# Altium schematic sheet Power.SchDoc: Power Supplies
size Tabloid; Organization: Davis Designs; Address1: Flycatcher Labs; SheetNumber: 4; SheetTotal: 6
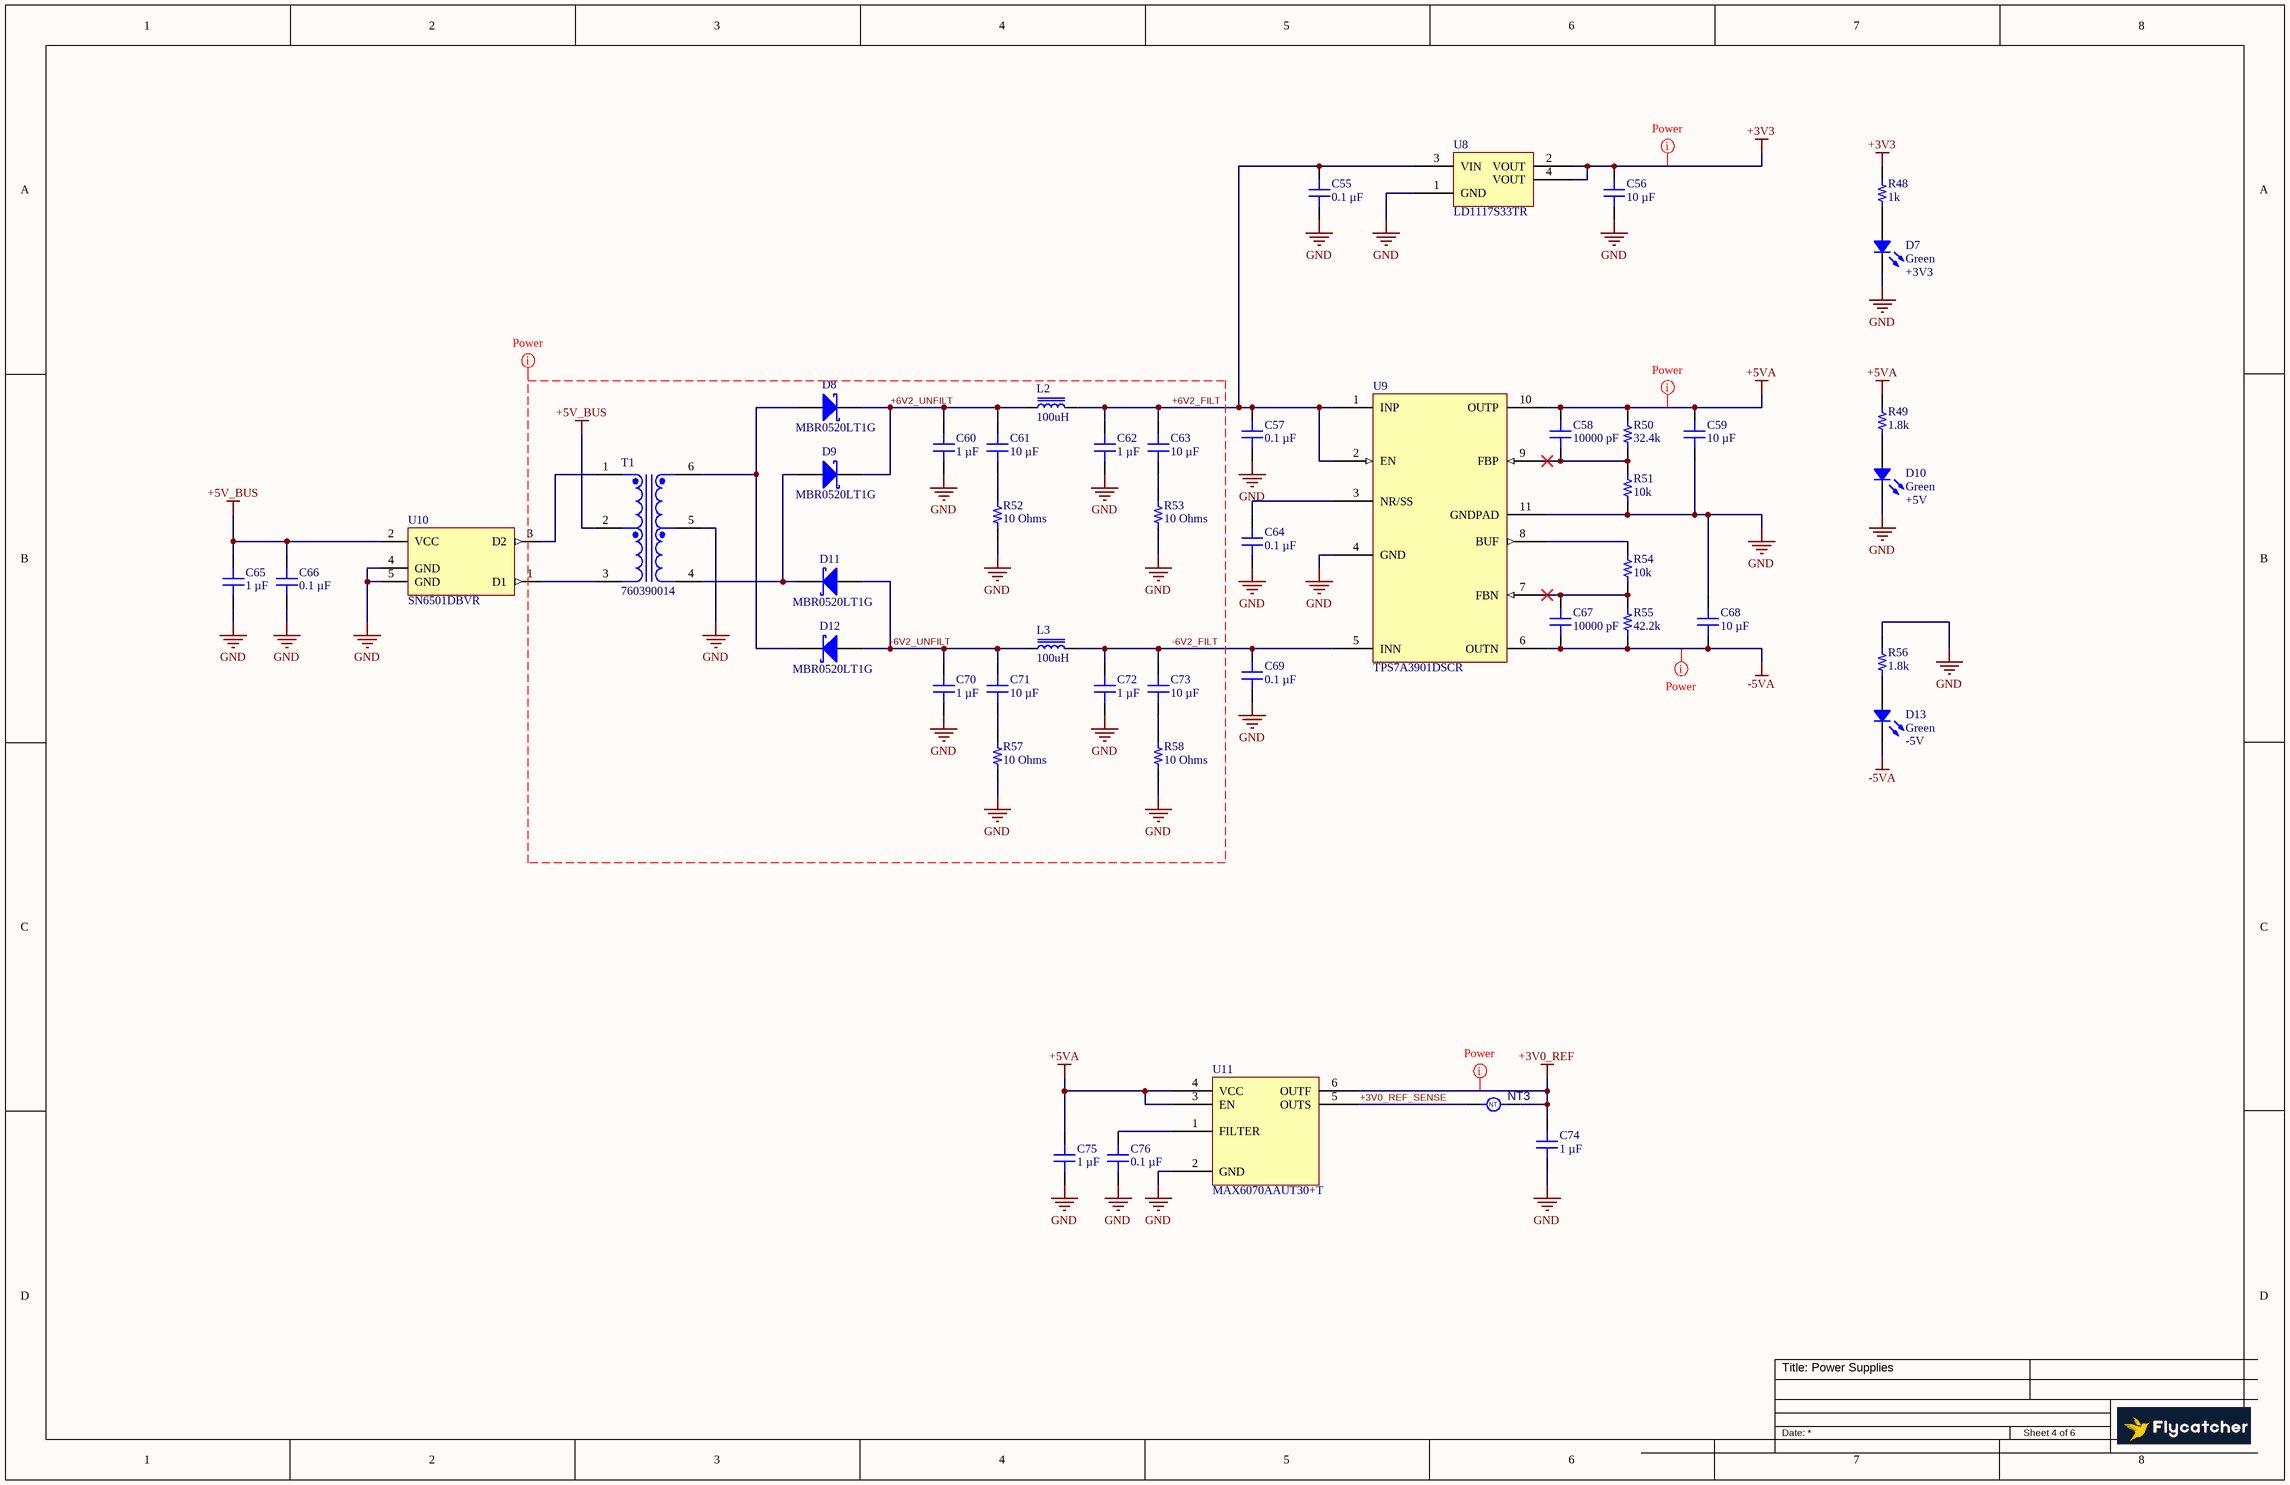
[diagram p0: Power.SchDoc]

## Parts
C55  0.1 µF  [MURATA GRM155 0402_1005]
C56  10 µF  [CAP 0805_2012]
C57  0.1 µF  [MURATA GRM155 0402_1005]
C58  10000 pF  [MURATA GRM155 0402_1005]
C59  10 µF  [CAP 0805_2012]
C60  1 µF  [MURATA GRM155 0402_1005]
C61  10 µF  [CAP 0805_2012]
C62  1 µF  [MURATA GRM155 0402_1005]
C63  10 µF  [CAP 0805_2012]
C64  0.1 µF  [MURATA GRM155 0402_1005]
C65  1 µF  [MURATA GRM155 0402_1005]
C66  0.1 µF  [MURATA GRM155 0402_1005]
C67  10000 pF  [MURATA GRM155 0402_1005]
C68  10 µF  [CAP 0805_2012]
C69  0.1 µF  [MURATA GRM155 0402_1005]
C70  1 µF  [MURATA GRM155 0402_1005]
C71  10 µF  [CAP 0805_2012]
C72  1 µF  [MURATA GRM155 0402_1005]
C73  10 µF  [CAP 0805_2012]
C74  1 µF  [MURATA GRM155 0402_1005]
C75  1 µF  [MURATA GRM155 0402_1005]
C76  0.1 µF  [MURATA GRM155 0402_1005]
D7  +3V3  value Green  [LED 0402_1005 GREEN]
D8  MBR0520LT1G  [ONSC-SOD-123-2-425-04_V]
D9  MBR0520LT1G  [ONSC-SOD-123-2-425-04_V]
D10  +5V  value Green  [LED 0402_1005 GREEN]
D11  MBR0520LT1G  [ONSC-SOD-123-2-425-04_V]
D12  MBR0520LT1G  [ONSC-SOD-123-2-425-04_V]
D13  -5V  value Green  [LED 0402_1005 GREEN]
L2  value 100uH  [FP-SRN4030HA-MFG]  (hidden comment: SRN4030HA-101M)
L3  value 100uH  [FP-SRN4030HA-MFG]  (hidden comment: SRN4030HA-101M)
NT3  Net Tie 10x8mil  [New footprint 1]  (value not drawn)  (net tie, no BOM)
R48  1k  [RES 0402_1005]
R49  1.8k  [RES 0402_1005]
R50  32.4k  [RES 0402_1005]
R51  10k  [RES 0402_1005]
R52  10 Ohms  [RES 0402_1005]
R53  10 Ohms  [RES 0402_1005]
R54  10k  [RES 0402_1005]
R55  42.2k  [RES 0402_1005]
R56  1.8k  [RES 0402_1005]
R57  10 Ohms  [RES 0402_1005]
R58  10 Ohms  [RES 0402_1005]
T1  760390014  [WE-760390014-6_V]
U8  LD1117S33TR  [ST SOT-223]
U9  TPS7A3901DSCR  [FP-DSC0010J-MFG]
U10  SN6501DBVR  [FP-DBV0005A-MFG]
U11  MAX6070AAUT30+T  [MAXIM SOT-23-6]

## Nets
+3V0_REF: C74.2 NT3.2 U11.6(OUTF)
+3V3: C56.2 R48.2 U8.2(VOUT) U8.4(VOUT)
+5V_BUS: C65.2 C66.2 T1.2 U10.2(VCC)
+5VA: C58.2 C59.2 C75.2 R49.2 R50.2 U9.10(OUTP) U11.3(EN) U11.4(VCC)
-5VA: C67.1 C68.1 D13.2 R55.1 U9.6(OUTN)
GND: C55.1 C56.1 C57.1 C59.1 C60.1 C62.1 C64.1 C65.1 C66.1 C68.2 C69.1 C70.1 C72.1 C74.1 C75.1 C76.1 D7.2 D10.2 R51.2 R52.1 R53.1 R56.2 R57.1 R58.1 T1.5 U8.1(GND) U9.4(GND) U9.11(GNDPAD) U10.4(GND) U10.5(GND) U11.2(GND)
+3V0_REF_SENSE: NT3.1 U11.5(OUTS)
+6V2_FILT: C55.2 C57.2 C62.2 C63.2 L2.2 U8.3(VIN) U9.1(INP) U9.2(EN)
+6V2_UNFILT: C60.2 C61.2 D8.2(K) D9.2(K) L2.1
-6V2_FILT: C69.2 C72.2 C73.2 L3.2 U9.5(INN)
-6V2_UNFILT: C70.2 C71.2 D11.1(A) D12.1(A) L3.1
NetC58_1: C58.1 R50.1 R51.1 U9.9(FBP)
NetC61_1: C61.1 R52.2
NetC63_1: C63.1 R53.2
NetC64_2: C64.2 U9.3(NR/SS)
NetC67_2: C67.2 R54.2 R55.2 U9.7(FBN)
NetC71_1: C71.1 R57.2
NetC73_1: C73.1 R58.2
NetC76_2: C76.2 U11.1(FILTER)
NetD7_1: D7.1 R48.1
NetD8_1: D8.1(A) D12.2(K) T1.6
NetD9_1: D9.1(A) D11.2(K) T1.4
NetD10_1: D10.1 R49.1
NetD13_1: D13.1 R56.1
NetR54_1: R54.1 U9.8(BUF)
NetT1_1: T1.1 U10.3(D2)
NetT1_3: T1.3 U10.1(D1)

## Layout directives
net class Power: +3V0_REF, +3V3, +5V_BUS, +5VA, +6V2_FILT, +6V2_UNFILT, -5VA, -6V2_FILT, -6V2_UNFILT, GND

## Notes on the sheet
- (in symbol CMP-009-00116-4) NT

## Library data of the parts
C55 C57 C64 C66 C69 C76 = GRM155R61H104KE19D: CAP CER 0.1UF 50V X5R 0402; manufacturer: Murata Electronics; Tolerance: ±10%; Part Number: GRM155R61H104KE19D; Value: 0.1 µF; Applications: General Purpose; Capacitance: 0.1 µF; componentlink1description: Datasheet; componentlink1url: https://search.murata.co.jp/Ceramy/image/img/A01X/G101/ENG/GRM155R61H104KE19-01.pdf; componentlink2description: DigiKey Link; componentlink2url: https://www.digikey.com/en/products/detail/murata-electronics/GRM155R61H104KE19D/5360887; Device Package: 0402 (1005 Metric); lastupdated: 7/25/2024 4:50:24 AM; Lifecycle Status: Active; Minimum Order: 1; Mounting Type: Surface Mount, MLCC; Operating Temperature: -55°C ~ 85°C; Package / Case: 0402 (1005 Metric); packaging: TapeAndReel; partid: 2975; Part Status: Active; price: 0.01; series: GRM; Size / Dimension: 0.039" L x 0.020" W (1.00mm x 0.50mm); Supplier 1: DigiKey; Supplier Part Number 1: 490-11917-1-ND; Temperature Coefficient: X5R; Thickness (Max): 0.022" (0.55mm); Voltage - Rated: 50V
C56 C59 C61 C63 C68 C71 C73 = GCM21BC71E106KE36L: CAP CER 10UF 25V X7S 0805; manufacturer: Murata Electronics; Tolerance: ±10%; Part Number: GCM21BC71E106KE36L; Value: 10 µF; Applications: Automotive; Capacitance: 10 µF; componentlink1description: Datasheet; componentlink1url: https://search.murata.co.jp/Ceramy/image/img/A01X/G101/ENG/GCM21BC71E106KE36-01A.pdf; componentlink2description: DigiKey Link; componentlink2url: https://www.digikey.com/en/products/detail/murata-electronics/GCM21BC71E106KE36L/16821116; Device Package: 0805 (2012 Metric); lastupdated: 2/9/2024 8:14:44 PM; Lifecycle Status: Active; Minimum Order: 1; Mounting Type: Surface Mount, MLCC; Operating Temperature: -55°C ~ 125°C; Package / Case: 0805 (2012 Metric); packaging: TapeAndReel; partid: 48794; Part Status: Active; price: 0.09; Ratings: AEC-Q200; series: GCM; Size / Dimension: 0.079" L x 0.049" W (2.00mm x 1.25mm); Supplier 1: DigiKey; Supplier Part Number 1: 490-GCM21BC71E106KE36LCT-ND; Temperature Coefficient: X7S; Thickness (Max): 0.057" (1.45mm); Voltage - Rated: 25V
C58 C67 = GRM1555CYA103GE01D: CAP CER 10000PF 35V C0G/NP0 0402; manufacturer: Murata Electronics; Temperature Coefficient: C0G, NP0; Tolerance: ±2%; Part Number: GRM1555CYA103GE01D; Value: 10000 pF; Applications: General Purpose; Capacitance: 10000 pF; componentlink1description: Datasheet; componentlink1url: https://search.murata.co.jp/Ceramy/image/img/A01X/G101/ENG/GRM1555CYA103GE01-01A.pdf; componentlink2description: DigiKey Link; componentlink2url: https://www.digikey.com/en/products/detail/murata-electronics/GRM1555CYA103GE01D/16033798; Device Package: 0402 (1005 Metric); lastupdated: 8/27/2024 12:42:50 PM; Lifecycle Status: Active; Minimum Order: 1; Mounting Type: Surface Mount, MLCC; Operating Temperature: -55°C ~ 125°C; Package / Case: 0402 (1005 Metric); packaging: TapeAndReel; partid: 41078; Part Status: Active; price: 0.02; series: GRM; Size / Dimension: 0.039" L x 0.020" W (1.00mm x 0.50mm); Supplier 1: DigiKey; Supplier Part Number 1: 490-GRM1555CYA103GE01DCT-ND; Thickness (Max): 0.026" (0.65mm); Voltage - Rated: 35V
C60 C62 C65 C70 C72 C74 C75 = GRM155R61E105MA12D: CAP CER 1UF 25V X5R 0402; manufacturer: Murata Electronics; Tolerance: ±20%; Part Number: GRM155R61E105MA12D; Value: 1 µF; Applications: General Purpose; Capacitance: 1 µF; componentlink1description: Datasheet; componentlink1url: https://search.murata.co.jp/Ceramy/image/img/A01X/G101/ENG/GRM155R61E105MA12-01.pdf; componentlink2description: DigiKey Link; componentlink2url: https://www.digikey.com/en/products/detail/murata-electronics/GRM155R61E105MA12D/4905141; Device Package: 0402 (1005 Metric); lastupdated: 7/25/2024 4:50:24 AM; Lifecycle Status: Active; Minimum Order: 1; Mounting Type: Surface Mount, MLCC; Operating Temperature: -55°C ~ 85°C; Package / Case: 0402 (1005 Metric); packaging: TapeAndReel; partid: 3014; Part Status: Active; price: 0.01; series: GRM; Size / Dimension: 0.039" L x 0.020" W (1.00mm x 0.50mm); Supplier 1: DigiKey; Supplier Part Number 1: 490-10018-1-ND; Temperature Coefficient: X5R; Thickness (Max): 0.022" (0.55mm); Voltage - Rated: 25V
D7 D10 D13 = HSMG-C280: LED GREEN DIFFUSED 0402 SMD; Manufacturer: Broadcom Limited; Configuration: Standard; Current - Test: 20mA; Lens Color: White; Lens Size: 1.00mm x 0.50mm; Lens Style: Rectangle with Flat Top; Millicandela Rating: 15mcd; Viewing Angle: 130°; Voltage - Forward (Vf) (Typ): 2.2V; Wavelength - Dominant: 572nm; Wavelength - Peak: 570nm; Part Number: HSMG-C280; Color: Green; ComponentLink1Description: Datasheet; ComponentLink1URL: https://docs.broadcom.com/docs/AV02-0602EN; ComponentLink2Description: DigiKey Link; ComponentLink2URL: https://www.digikey.com/en/products/detail/broadcom-limited/HSMG-C280/1235358; Device Package: 0402 (1005 Metric); Height (Max): 0.40mm; LastUpdated: 3/11/2024 7:50:32 AM; Lens Transparency: Diffused; Lifecycle Status: Active; Minimum Order: 1; Mounting Type: Surface Mount; Package / Case: 0402 (1005 Metric); Packaging: TapeAndReel; PartId: 697; Part Status: Active; Price: 0.08; Series: -; Size / Dimension: 1.00mm L x 0.50mm W; Supplier 1: DigiKey; Supplier Part Number 1: 516-3066-1-ND; Supplier Device Package: 0402
D8 D9 D11 D12 = CMP-004-00003-2: Schottky Power Rectifier, 20 V, 5.5 A, -65 to 125 degC, 2-Pin SMD, RoHS, Tape and Reel; Manufacturer: ON Semiconductor; Forward Current: 500mA; Peak Reverse Current: 250uA; Elements: 1; Forward Voltage: 385mV; Max Surge Current: 5.5A; Max Operating Temperature: 125°C; Min Operating Temperature: -65°C; Mounting Technology: SM; Datasheet URL: http://www.onsemi.cn/pub_link/Collateral/MBR0520LT1-D.PDF; RoHS Compliant: True; Pins: 2; Package Quantity: 3000; Case/Package: SOD; Package Reference: SOD-123-2-425-04; Package Description: 2-Pin Surface Mount Device, Body 2.69 x 1.6 mm; Packaging: TapeandReel; Manufacturer URL: http://www.onsemi.com/; Datasheet Version: Rev. 6, 01/2012
L2 L3 = CMP-006-00029-3: Inductor Power Semi-Shielded Wirewound 100uH 20% 100kHz 26Q Factor Ferrite 0.55A SMD T/R; Manufacturer: Bourns; Current Saturation: 700mA; Self Resonant Frequency: 7MHz; Current Rating: 550mA; Manufacturer Part Number: SRN4030HA-101M; ComponentLink1Description: Datasheet; ComponentLink1URL: https://mm.digikey.com/Volume0/opasdata/d220001/medias/docus/5336/SRN4030HA_Series_DS.pdf; Case/Package: 4mm x 4mm
NT3 = CMP-009-00116-4: Pins: 2; Max Operating Temperature: 155°C; Min Operating Temperature: -55°C; ClassName: NetTie
R48 = ERA-2AEB102X: RES SMD 1K OHM 0.1% 1/16W 0402; Manufacturer: Panasonic Electronic Components; Value: 1 kOhms; Power (Watts): 0.063W, 1/16W; Temperature Coefficient: ±25ppm/°C; Part Number: ERA-2AEB102X; ComponentLink1Description: Datasheet; ComponentLink1URL: https://industrial.panasonic.com/cdbs/www-data/pdf/RDM0000/AOA0000C307.pdf; ComponentLink2Description: DigiKey Link; ComponentLink2URL: https://www.digikey.com/en/products/detail/panasonic-electronic-components/ERA-2AEB102X/1706005; Composition: Thin Film; Device Package: 0402 (1005 Metric); Features: Automotive AEC-Q200; Height - Seated (Max): 0.016" (0.40mm); LastUpdated: 2/9/2024 8:30:08 PM; Lifecycle Status: Active; Minimum Order: 1; Number of Terminations: 2; Operating Temperature: -55°C ~ 155°C; Package / Case: 0402 (1005 Metric); Packaging: TapeAndReel; PartId: 6077; Part Status: Active; Price: 0.04; Ratings: AEC-Q200; Resistance: 1 kOhms; Series: ERA-2A; Size / Dimension: 0.039" L x 0.020" W (1.00mm x 0.50mm); Supplier 1: DigiKey; Supplier Part Number 1: P1.0KDCCT-ND; Supplier Device Package: 0402; Tolerance: ±0.1%
R49 R56 = CRCW04021K80FKED: RES SMD 1.8K OHM 1% 1/16W 0402; Manufacturer: Vishay Dale; Value: 1.8 kOhms; Power (Watts): 0.063W, 1/16W; Temperature Coefficient: ±100ppm/°C; Part Number: CRCW04021K80FKED; ComponentLink1Description: Datasheet; ComponentLink1URL: http://www.vishay.com/docs/20035/dcrcwe3.pdf; ComponentLink2Description: DigiKey Link; ComponentLink2URL: https://www.digikey.com/en/products/detail/vishay-dale/CRCW04021K80FKED/1178034; Composition: Thick Film; Device Package: 0402 (1005 Metric); Features: Automotive AEC-Q200; Height - Seated (Max): 0.016" (0.40mm); LastUpdated: 2/9/2024 8:29:55 PM; Lifecycle Status: Active; Minimum Order: 1; Number of Terminations: 2; Operating Temperature: -55°C ~ 155°C; Package / Case: 0402 (1005 Metric); Packaging: TapeAndReel; PartId: 10328; Part Status: Active; Price: 0.01; Ratings: AEC-Q200; Resistance: 1.8 kOhms; Series: CRCW; Size / Dimension: 0.039" L x 0.020" W (1.00mm x 0.50mm); Supplier 1: DigiKey; Supplier Part Number 1: 541-1.80KLCT-ND; Supplier Device Package: 0402; Tolerance: ±1%
R50 = CRCW040232K4FKED: RES SMD 32.4K OHM 1% 1/16W 0402; Manufacturer: Vishay Dale; Value: 32.4 kOhms; Power (Watts): 0.063W, 1/16W; Temperature Coefficient: ±100ppm/°C; Part Number: CRCW040232K4FKED; ComponentLink1Description: Datasheet; ComponentLink1URL: http://www.vishay.com/docs/20035/dcrcwe3.pdf; ComponentLink2Description: DigiKey Link; ComponentLink2URL: https://www.digikey.com/en/products/detail/vishay-dale/CRCW040232K4FKED/1178177; Composition: Thick Film; Device Package: 0402 (1005 Metric); Features: Automotive AEC-Q200; Height - Seated (Max): 0.016" (0.40mm); LastUpdated: 2/9/2024 8:29:30 PM; Lifecycle Status: Active; Minimum Order: 1; Number of Terminations: 2; Operating Temperature: -55°C ~ 155°C; Package / Case: 0402 (1005 Metric); Packaging: TapeAndReel; PartId: 18805; Part Status: Active; Price: 0.01; Ratings: AEC-Q200; Resistance: 32.4 kOhms; Series: CRCW; Size / Dimension: 0.039" L x 0.020" W (1.00mm x 0.50mm); Supplier 1: DigiKey; Supplier Part Number 1: 541-32.4KLCT-ND; Supplier Device Package: 0402; Tolerance: ±1%
R51 R54 = ERA-2VRW1002X: RES 10K OHM 0.05% 1/10W 0402; Manufacturer: Panasonic Electronic Components; Value: 10 kOhms; Power (Watts): 0.1W, 1/10W; Temperature Coefficient: ±10ppm/°C; Part Number: ERA-2VRW1002X; ComponentLink1Description: Datasheet; ComponentLink1URL: https://api.pim.na.industrial.panasonic.com/file_stream/main/fileversion/9152; ComponentLink2Description: DigiKey Link; ComponentLink2URL: https://www.digikey.com/en/products/detail/panasonic-electronic-components/ERA-2VRW1002X/12085128; Composition: Thin Film; Device Package: 0402 (1005 Metric); Height - Seated (Max): 0.016" (0.40mm); LastUpdated: 2/9/2024 8:28:44 PM; Lifecycle Status: Active; Minimum Order: 1; Number of Terminations: 2; Operating Temperature: -55°C ~ 155°C; Package / Case: 0402 (1005 Metric); Packaging: TapeAndReel; PartId: 70282; Part Status: Active; Price: 0.21; Resistance: 10 kOhms; Series: ERA-2V; Size / Dimension: 0.039" L x 0.020" W (1.00mm x 0.50mm); Supplier 1: DigiKey; Supplier Part Number 1: 10-ERA-2VRW1002XCT-ND; Supplier Device Package: 0402; Tolerance: ±0.05%; Features: Anti-Sulfur, Automotive AEC-Q200; Ratings: AEC-Q200
R52 R53 R57 R58 = CRCW040210R0FKEDC: RES 10 OHM 1% 1/16W 0402; Manufacturer: Vishay Dale; Power (Watts): 0.063W, 1/16W; Temperature Coefficient: ±100ppm/°C; Part Number: CRCW040210R0FKEDC; Value: 10 Ohms; ComponentLink1Description: Datasheet; ComponentLink1URL: http://www.vishay.com/docs/28773/crcwce3.pdf; ComponentLink2Description: DigiKey Link; ComponentLink2URL: https://www.digikey.com/en/products/detail/vishay-dale/CRCW040210R0FKEDC/7928386; Composition: Thick Film; Device Package: 0402 (1005 Metric); Height - Seated (Max): 0.014" (0.35mm); LastUpdated: 2/9/2024 8:29:48 PM; Lifecycle Status: Active; Minimum Order: 1; Number of Terminations: 2; Operating Temperature: -55°C ~ 155°C; Package / Case: 0402 (1005 Metric); Packaging: CutTape; PartId: 12688; Part Status: Active; Price: 0.01; Resistance: 10 Ohms; Series: CRCW-C; Size / Dimension: 0.039" L x 0.020" W (1.00mm x 0.50mm); Supplier 1: DigiKey; Supplier Part Number 1: 541-3964-1-ND; Supplier Device Package: 0402; Tolerance: ±1%
R55 = CRCW040242K2FKED: RES SMD 42.2K OHM 1% 1/16W 0402; Manufacturer: Vishay Dale; Value: 42.2 kOhms; Power (Watts): 0.063W, 1/16W; Temperature Coefficient: ±100ppm/°C; Part Number: CRCW040242K2FKED; ComponentLink1Description: Datasheet; ComponentLink1URL: http://www.vishay.com/docs/20035/dcrcwe3.pdf; ComponentLink2Description: DigiKey Link; ComponentLink2URL: https://www.digikey.com/en/products/detail/vishay-dale/CRCW040242K2FKED/1178191; Composition: Thick Film; Device Package: 0402 (1005 Metric); Features: Automotive AEC-Q200; Height - Seated (Max): 0.016" (0.40mm); LastUpdated: 2/9/2024 8:29:54 PM; Lifecycle Status: Active; Minimum Order: 1; Number of Terminations: 2; Operating Temperature: -55°C ~ 155°C; Package / Case: 0402 (1005 Metric); Packaging: TapeAndReel; PartId: 10469; Part Status: Active; Price: 0.01; Ratings: AEC-Q200; Resistance: 42.2 kOhms; Series: CRCW; Size / Dimension: 0.039" L x 0.020" W (1.00mm x 0.50mm); Supplier 1: DigiKey; Supplier Part Number 1: 541-42.2KLCT-ND; Supplier Device Package: 0402; Tolerance: ±1%
T1 = CMP-012-00005-3: Audio & Signal Transformer, 475 uH, -40 to 125 degC, 6-Pin SMD, RoHS, Tape and Reel; Manufacturer: Wuerth Elektronik; Inductance: 475uH; Mounting Technology: SurfaceMount; Datasheet URL: https://datasheet.ciiva.com/12335/760390014-221199-12335395.pdf; Package Reference: 760390014; Package Description: 6-Pin Surface Mounted Device, Body 7.14 x 6.73 mm, Pitch 2.54 mm; Min Operating Temperature: -40°C; RoHS Compliant: True; Max Operating Temperature: 125°C; Pins: 6; Case/Package: SMD; Datasheet Version: Rev. 6C, 06/2013
U8 = LD1117S33TR: IC REG LINEAR 3.3V 800MA SOT223; Manufacturer: STMicroelectronics; Current - Quiescent (Iq): 10 mA; Number of Regulators: 1; Output Configuration: Positive; Output Type: Fixed; Protection Features: Over Current, Over Temperature; PSRR: 75dB (120Hz); Voltage Dropout (Max): 1.2V @ 800mA; Voltage - Input (Max): 15V; Part Number: LD1117S33TR; ComponentLink1Description: Datasheet; ComponentLink1URL: http://www.st.com/content/ccc/resource/technical/document/datasheet/99/3b/7d/91/91/51/4b/be/CD00000544.pdf/files/CD00000544.pdf/jcr:content/translations/en.CD00000544.pdf; ComponentLink2Description: DigiKey Link; ComponentLink2URL: https://www.digikey.com/en/products/detail/stmicroelectronics/LD1117S33TR/585766; Current - Output: 800mA; LastUpdated: 6/3/2024 8:14:20 PM; Lifecycle Status: Active; Minimum Order: 1; Mounting Type: Surface Mount; Operating Temperature: 0°C ~ 125°C; Package / Case: TO-261-4, TO-261AA; Packaging: TapeAndReel; Part Status: Active; Price: 0.13; Series: -; Supplier 1: DigiKey; Supplier Part Number 1: 497-1242-1-ND; Supplier Device Package: SOT-223; Voltage - Output (Min/Fixed): 3.3V
U9 = CMP-019-00059-2: Adjustable Positive LDO Regulator, 1.2V Min, 30V Max, 0.5V Dropout, BIPolar, PDSO10; Number of Channels: 2; Max Supply Voltage: 33V; Min Output Voltage: 0V; Power Supply Rejection Ratio (PSRR): 69dB; Accuracy: 2.5%; Quiescent Current: 150uA; Output Current: 150mA; Min Supply Voltage: 3.3V; Max Output Voltage: -30V; Max Supply Current: 904uA; Mounting Technology: Surface Mount; Series: -; ComponentLink1Description: Datasheet; Pins: 10; Min Operating Temperature: -40°C; Output Type: Adjustable; Packaging: Cut Tape; Length: 3mm; Height: 800um; Max Operating Temperature: 125°C; Number of Outputs: 2; Thickness: 750um; Width: 3mm; Number of Regulators: 2; ComponentLink1URL: https://www.ti.com/lit/ds/symlink/tps7a39.pdf
U10 = CMP-019-00057-2: Transformer Driver PMIC SOT-23-5; Min Supply Voltage: 3V; Max Output current: 350mA; Max Power Dissipation: 250mW; Max Supply Voltage: 5.5V; Output Type: Adjustable; Number of Outputs: 1; Output Current: 250mA; Switching Frequency: 620kHz; Output Voltage: 11V; Operating Supply Current: 300uA; Max Operating Temperature: 125°C; Height: 1.45mm; Min Operating Temperature: -40°C; ComponentLink1URL: https://www.ti.com/lit/ds/symlink/sn6501.pdf; Package Quantity: 3000; Packaging: Tape and Reel; Thickness: 1.2mm; Series: -; Mounting Technology: Surface Mount; Width: 1.6mm; Case/Package: SOT-23-5; Reach SVHC Compliant: No; ComponentLink1Description: Datasheet; Lead Free: Lead Free; Length: 2.9mm; RoHS Compliant: Yes; Min Input Voltage: 3V; Pins: 5
U11 = MAX6070AAUT30+T: IC VREF SERIES 0.04% SOT23-6; Manufacturer: Maxim Integrated; Current - Output: 10mA; Current - Supply: 300µA; Noise - 0.1Hz to 10Hz: 4.6µVp-p; Noise - 10Hz to 10kHz: 5µVrms; Output Type: Fixed; Temperature Coefficient: 6ppm/°C; Voltage - Input: 3.2V ~ 5.5V; Voltage - Output (Min/Fixed): 3V; Part Number: MAX6070AAUT30+T; ComponentLink1Description: Datasheet; ComponentLink1URL: https://datasheets.maximintegrated.com/en/ds/MAX6070-MAX6071.pdf; ComponentLink2Description: DigiKey Link; ComponentLink2URL: http://digikey.com/product-detail/en/maxim-integrated/MAX6070AAUT30-T/MAX6070AAUT30-TCT-ND/5051499; LastUpdated: 6/3/2024 8:15:04 PM; Lifecycle Status: Active; Minimum Order: 1; Mounting Type: Surface Mount; Operating Temperature: -40°C ~ 125°C (TA); Package / Case: SOT-23-6; Packaging: CutTape; Part Status: Active; Price: 3.63; Reference Type: Series; Series: -; Supplier 1: DigiKey; Supplier Part Number 1: MAX6070AAUT30+TCT-ND; Supplier Device Package: SOT-23-6; Tolerance: ±0.04%